# Altium schematic sheet differential driver.SchDoc
size A; SheetNumber: 1; SheetTotal: 2
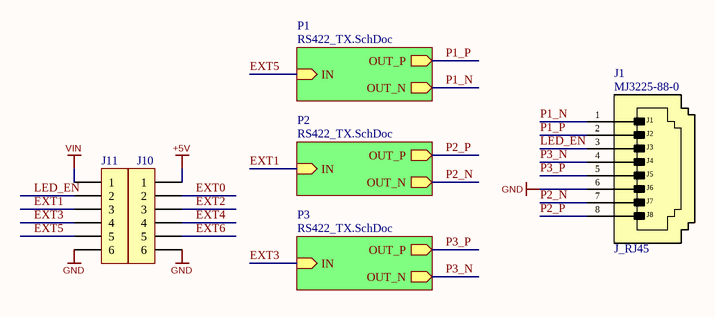
[diagram p0: differential driver.SchDoc]

## Parts
J1  value MJ3225-88-0  [J_RJ45_MJ3225-88-0]  (hidden comment: Modular Connector, Modular Jack, 1 x 1 (Port), 8P8C, Cat3)
J10  Goldpin  [P_HEADER_1x6_2.54]  (value not drawn)
J11  Goldpin  [P_HEADER_1x6_2.54]  (value not drawn)

## Sub-sheets
P1 = RS422_TX.SchDoc: IN (in), OUT_P (out), OUT_N (out)
P2 = RS422_TX.SchDoc: IN (in), OUT_P (out), OUT_N (out)
P3 = RS422_TX.SchDoc: IN (in), OUT_P (out), OUT_N (out)

## Nets
+5V: J10.1
GND: J1.6 J10.6 J11.6
VIN: J11.1
EXT0: J10.2
EXT1: J11.3 ; sheet P2/IN
EXT2: J10.3
EXT3: J11.4 ; sheet P3/IN
EXT4: J10.4
EXT5: J11.5 ; sheet P1/IN
EXT6: J10.5
LED_EN: J1.3 J11.2
P1_N: J1.1 ; sheet P1/OUT_N
P1_P: J1.2 ; sheet P1/OUT_P
P2_N: J1.7 ; sheet P2/OUT_N
P2_P: J1.8 ; sheet P2/OUT_P
P3_N: J1.4 ; sheet P3/OUT_N
P3_P: J1.5 ; sheet P3/OUT_P

## Notes on the sheet
- (in symbol J_RJ45_MJ3225-88-0) J2; J3; J4; J5; J6; J7; J8

## Library data of the parts
J1 = J_RJ45_MJ3225-88-0: Manufacturer: Global Connector Technology; SCH_Footprint: J_RJ45; Part Number: J_RJ45_MJ3225-88-0; HelpURL: https://www.farnell.com/cad/3781788.pdf; Manufacturer Part Number: MJ3225-88-0; Supplier 1: TME; Supplier 2: RS Components; Supplier 3: Farnell; Supplier Part Number 3: 4071641; Supplier 4: Mouser; Supplier 5: Digi-Key; Supplier 6: LCSC; Supplier 7: Newark; Supplier Part Number 7: 61AK4308
J10 J11 = P_HEADER_1x6_2.54: Pin Header; Manufacturer: Connfly; SCH_Footprint: 1x6 2.54mm; Value: DS1021-1*6SF1-1; Part Number: P_HEADER_1x6_2.54; HelpURL: http://www.tme.eu/en/Document/cc301e58a5da78cb543a94b5a5b7f06a/DS1021.pdf; Manufacturer Part Number: DS1021-1*6SF1-1; Supplier 1: TME; Supplier Part Number 1: ZL201-06G; Supplier 2: RS Components; Supplier 3: Farnell; Supplier 4: Mouser; Supplier 5: Digi-Key; Supplier 6: LCSC